# Altium schematic sheet 2019-07-21_05-20-361.schdoc
size 379 x 125 mm; SheetNumber: 1; SheetTotal: 1
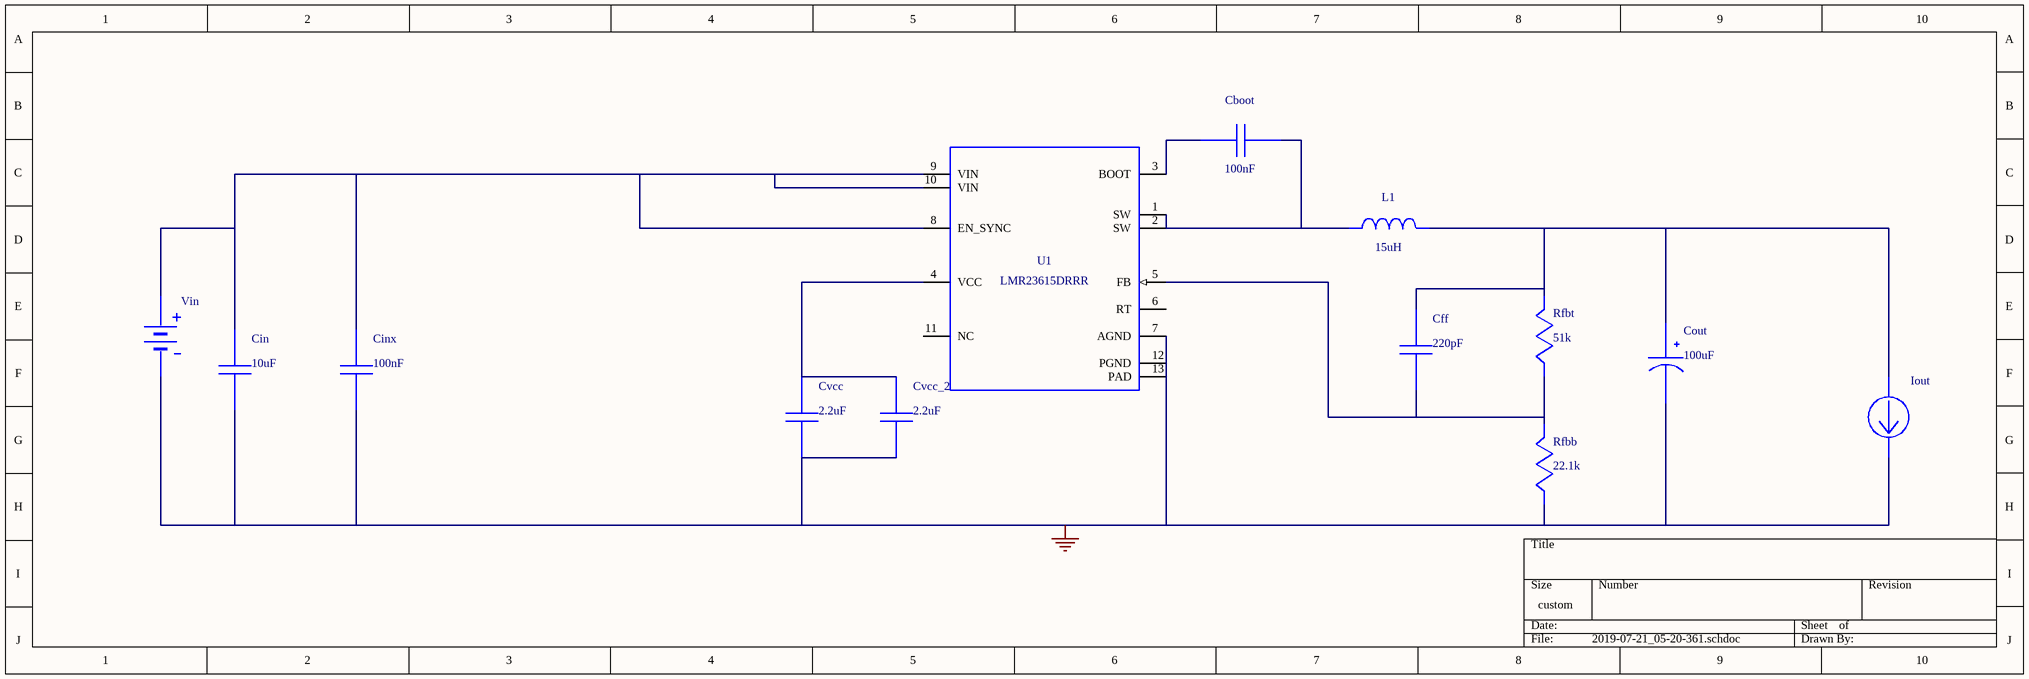
[diagram p0: 2019-07-21_05-20-361.schdoc]

## Parts
Cboot  value 100nF  (hidden comment: GRM155R71C104KA88D)
Cff  value 220pF  (hidden comment: CL05C221JA5NNNC)
Cin  value 10uF  (hidden comment: C3225X7R1H106M250AC)
Cinx  value 100nF  (hidden comment: CGA3E3X7S2A104K080AB)
Cout  value 100uF  (hidden comment: 6SVPC100MY)
Cvcc  value 2.2uF  (hidden comment: C0603C225K8PACTU)
Cvcc_2  value 2.2uF  (hidden comment: C0603C225K8PACTU)
Iout  WB_CURRENT_LOAD  (value not drawn)
L1  value 15uH  (hidden comment: SRN6045-150M)
Rfbb  value 22.1k  (hidden comment: CRCW040222K1FKED)
Rfbt  value 51k  (hidden comment: RC0603FR-0751KL)
U1  LMR23615DRRR
Vin  WB_BATTERY  (value not drawn)

## Nets
0: Cin.2 Cinx.2 Cout.2(-) Cvcc.2 Cvcc_2.2 Iout.2(-) Rfbb.2 U1.7(AGND) U1.12(PGND) U1.13(PAD) Vin.2(-)
NetCboot_1: Cboot.1 U1.3(BOOT)
NetCboot_2: Cboot.2 L1.1 U1.1(SW) U1.2(SW)
NetCff_1: Cff.1 Cout.1(+) Iout.1(+) L1.2 Rfbt.1
NetCff_2: Cff.2 Rfbb.1 Rfbt.2 U1.5(FB)
NetCin_1: Cin.1 Cinx.1 U1.8(EN_SYNC) U1.9(VIN) U1.10(VIN) Vin.1(+)
NetCvcc_1: Cvcc.1 Cvcc_2.1 U1.4(VCC)

Not connected (* = marked no-connect by the designer): U1 6(RT) 11(NC)

## Library data of the parts
Cboot = GRM155R71C104KA88D: GRM155R71C104KA8; Manufacturer Name: MuRata; PackageReference: GRM155R71C104KA88D; Manufacturer Part Number: GRM155R71C104KA88D
Cff = CL05C221JA5NNNC: Manufacturer Name: Samsung Electro-Mechanics; PackageReference: CL05C221JA5NNNC; Manufacturer Part Number: CL05C221JA5NNNC
Cin = C3225X7R1H106M250AC: C3225X7R1H106M25; Manufacturer Name: TDK; PackageReference: C3225X7R1H106M250AC; Manufacturer Part Number: C3225X7R1H106M250AC
Cinx = CGA3E3X7S2A104K080AB: CGA3E3X7S2A104K0; Manufacturer Name: TDK; PackageReference: CGA3E3X7S2A104K080AB; Manufacturer Part Number: CGA3E3X7S2A104K080AB
Cout = 6SVPC100MY: Manufacturer Name: Panasonic; PackageReference: 6SVPC100MY; Manufacturer Part Number: 6SVPC100MY
Cvcc Cvcc_2 = C0603C225K8PACTU: Manufacturer Name: Kemet; PackageReference: C0603C225K8PACTU; Manufacturer Part Number: C0603C225K8PACTU
L1 = SRN6045-150M: Manufacturer Name: Bourns; PackageReference: SRN6045-150M; Manufacturer Part Number: SRN6045-150M
Rfbb = CRCW040222K1FKED: Manufacturer Name: Vishay-Dale; PackageReference: CRCW040222K1FKED; Manufacturer Part Number: CRCW040222K1FKED
Rfbt = RC0603FR-0751KL: Manufacturer Name: Yageo; PackageReference: RC0603FR-0751KL; Manufacturer Part Number: RC0603FR-0751KL
U1 = LMR23615DRRR: Manufacturer Name: Texas Instruments; PackageReference: LMR23615DRRR; Manufacturer Part Number: LMR23615DRRR; Value: N/A
Iout = WB_CURRENT_LOAD: PackageReference: WB_CURRENT_LOAD; Manufacturer Part Number: WB_CURRENT_LOAD; Manufacturer Name: WB_CURRENT_LOAD; Value: N/A
Vin = WB_BATTERY: PackageReference: WB_BATTERY; Manufacturer Part Number: WB_BATTERY; Manufacturer Name: WB_BATTERY; Value: N/A